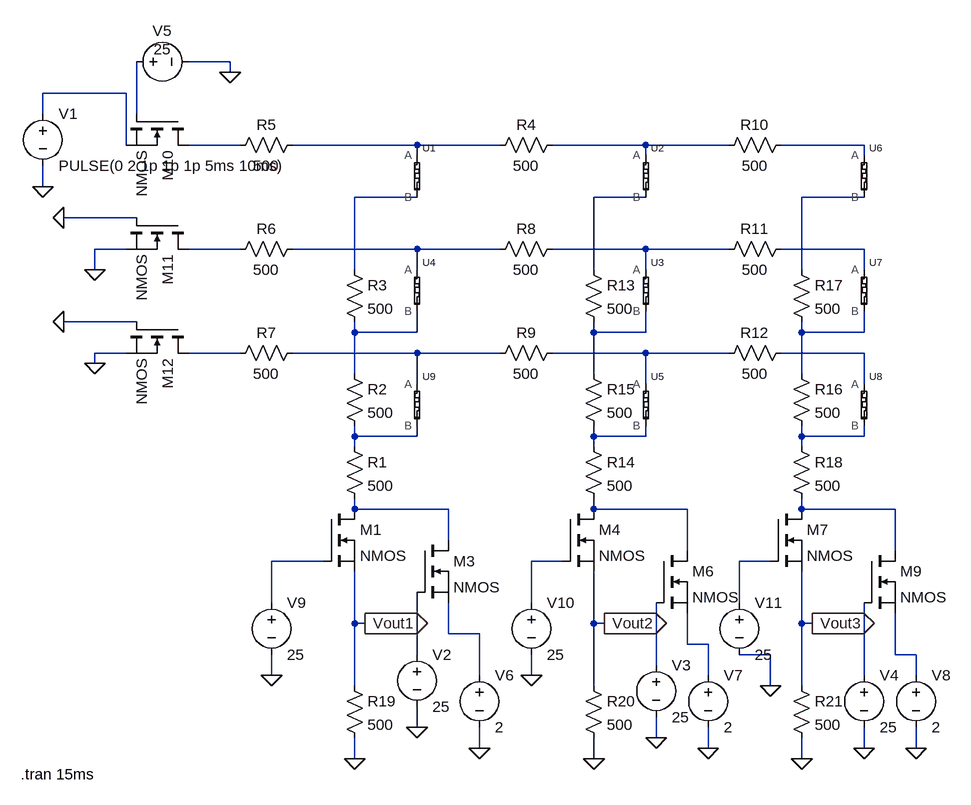
[diagram p0: schematic 3x3_crossbar.asc]
3x3_crossbar.asc, the LTspice schematic file:
Version 4
SHEET 1 1112 888
WIRE 0 -224 -64 -224
WIRE 0 -208 0 -224
WIRE -160 -176 -288 -176
WIRE -288 -144 -288 -176
WIRE -144 -144 -144 -224
WIRE -160 -96 -160 -176
WIRE 16 -96 -64 -96
WIRE 288 -96 96 -96
WIRE 416 -96 288 -96
WIRE 640 -96 496 -96
WIRE 768 -96 640 -96
WIRE 976 -96 848 -96
WIRE 288 -80 288 -96
WIRE 640 -80 640 -96
WIRE 976 -80 976 -96
WIRE -288 -32 -288 -64
WIRE 288 -16 192 -16
WIRE 640 -16 560 -16
WIRE 976 -16 880 -16
WIRE -144 16 -256 16
WIRE -160 64 -208 64
WIRE 16 64 -64 64
WIRE 288 64 96 64
WIRE 416 64 288 64
WIRE 640 64 496 64
WIRE 768 64 640 64
WIRE 976 64 848 64
WIRE -208 96 -208 64
WIRE 192 96 192 -16
WIRE 288 96 288 64
WIRE 560 96 560 -16
WIRE 640 96 640 64
WIRE 880 96 880 -16
WIRE 976 96 976 64
WIRE -144 176 -256 176
WIRE 192 192 192 176
WIRE 288 192 288 160
WIRE 288 192 192 192
WIRE 560 192 560 176
WIRE 640 192 640 160
WIRE 640 192 560 192
WIRE 880 192 880 176
WIRE 976 192 976 160
WIRE 976 192 880 192
WIRE -160 224 -208 224
WIRE 16 224 -64 224
WIRE 288 224 96 224
WIRE 416 224 288 224
WIRE 640 224 496 224
WIRE 768 224 640 224
WIRE 976 224 848 224
WIRE -208 240 -208 224
WIRE 192 256 192 192
WIRE 560 256 560 192
WIRE 880 256 880 192
WIRE 288 272 288 224
WIRE 640 272 640 224
WIRE 976 272 976 224
WIRE 192 352 192 336
WIRE 288 352 288 336
WIRE 288 352 192 352
WIRE 560 352 560 336
WIRE 640 352 640 336
WIRE 640 352 560 352
WIRE 880 352 880 336
WIRE 976 352 976 336
WIRE 976 352 880 352
WIRE 192 368 192 352
WIRE 560 368 560 352
WIRE 880 368 880 352
WIRE 192 464 192 448
WIRE 336 464 192 464
WIRE 560 464 560 448
WIRE 704 464 560 464
WIRE 880 464 880 448
WIRE 1024 464 880 464
WIRE 336 512 336 464
WIRE 704 528 704 464
WIRE 1024 528 1024 464
WIRE 144 544 64 544
WIRE 512 544 464 544
WIRE 832 544 784 544
WIRE 64 608 64 544
WIRE 464 608 464 544
WIRE 784 608 784 544
WIRE 192 640 192 560
WIRE 208 640 192 640
WIRE 560 640 560 560
WIRE 576 640 560 640
WIRE 880 640 880 560
WIRE 896 640 880 640
WIRE 336 656 336 608
WIRE 384 656 336 656
WIRE 704 672 704 624
WIRE 736 672 704 672
WIRE 288 688 288 592
WIRE 832 688 784 688
WIRE 1024 688 1024 624
WIRE 1056 688 1024 688
WIRE 656 704 656 608
WIRE 64 720 64 688
WIRE 384 720 384 656
WIRE 464 720 464 688
WIRE 736 720 736 672
WIRE 976 720 976 608
WIRE 1056 720 1056 688
WIRE 192 736 192 640
WIRE 560 736 560 640
WIRE 832 736 832 688
WIRE 880 736 880 640
WIRE 288 800 288 768
WIRE 656 816 656 784
WIRE 384 832 384 800
WIRE 736 832 736 800
WIRE 976 832 976 800
WIRE 1056 832 1056 800
WIRE 192 848 192 816
WIRE 560 848 560 816
WIRE 880 848 880 816
FLAG 192 848 0
FLAG 560 848 0
FLAG 880 848 0
FLAG -256 16 0
FLAG -256 176 0
FLAG -288 -32 0
FLAG 288 800 0
FLAG 656 816 0
FLAG 976 832 0
FLAG 0 -208 0
FLAG -208 96 0
FLAG -208 240 0
FLAG 64 720 0
FLAG 464 720 0
FLAG 832 736 0
FLAG 1056 832 0
FLAG 384 832 0
FLAG 736 832 0
FLAG 208 640 Vout1
IOPIN 208 640 Out
FLAG 576 640 Vout2
IOPIN 576 640 Out
FLAG 896 640 Vout3
IOPIN 896 640 Out
SYMBOL memristor_k 320 -32 R0
SYMATTR InstName U1
SYMBOL memristor_k 320 144 R0
SYMATTR InstName U4
SYMBOL memristor_k 320 320 R0
SYMATTR InstName U9
SYMBOL nmos 144 464 R0
SYMATTR InstName M1
SYMBOL nmos 288 512 R0
SYMATTR InstName M3
SYMBOL nmos 512 464 R0
SYMATTR InstName M4
SYMBOL nmos 656 528 R0
SYMATTR InstName M6
SYMBOL nmos 832 464 R0
SYMATTR InstName M7
SYMBOL nmos 976 528 R0
SYMATTR InstName M9
SYMBOL res 176 352 R0
SYMATTR InstName R1
SYMATTR Value 500
SYMBOL res 176 240 R0
SYMATTR InstName R2
SYMATTR Value 500
SYMBOL res 176 80 R0
SYMATTR InstName R3
SYMATTR Value 500
SYMBOL res 112 -112 R90
WINDOW 0 0 56 VBottom 2
WINDOW 3 32 56 VTop 2
SYMATTR InstName R5
SYMATTR Value 500
SYMATTR SpiceLine tol=1 pwr=0.1
SYMBOL res 112 48 R90
WINDOW 0 0 56 VBottom 2
WINDOW 3 32 56 VTop 2
SYMATTR InstName R6
SYMATTR Value 500
SYMBOL res 112 208 R90
WINDOW 0 0 56 VBottom 2
WINDOW 3 32 56 VTop 2
SYMATTR InstName R7
SYMATTR Value 500
SYMBOL nmos -64 -144 R90
SYMATTR InstName M10
SYMBOL nmos -64 16 R90
SYMATTR InstName M11
SYMBOL nmos -64 176 R90
SYMATTR InstName M12
SYMBOL memristor_k 672 -32 R0
SYMATTR InstName U2
SYMBOL memristor_k 672 144 R0
SYMATTR InstName U3
SYMBOL memristor_k 672 320 R0
SYMATTR InstName U5
SYMBOL memristor_k 1008 -32 R0
SYMATTR InstName U6
SYMBOL memristor_k 1008 144 R0
SYMATTR InstName U7
SYMBOL memristor_k 1008 320 R0
SYMATTR InstName U8
SYMBOL res 512 -112 R90
WINDOW 0 0 56 VBottom 2
WINDOW 3 32 56 VTop 2
SYMATTR InstName R4
SYMATTR Value 500
SYMBOL res 512 48 R90
WINDOW 0 0 56 VBottom 2
WINDOW 3 32 56 VTop 2
SYMATTR InstName R8
SYMATTR Value 500
SYMBOL res 512 208 R90
WINDOW 0 0 56 VBottom 2
WINDOW 3 32 56 VTop 2
SYMATTR InstName R9
SYMATTR Value 500
SYMBOL res 864 -112 R90
WINDOW 0 0 56 VBottom 2
WINDOW 3 32 56 VTop 2
SYMATTR InstName R10
SYMATTR Value 500
SYMBOL res 864 48 R90
WINDOW 0 0 56 VBottom 2
WINDOW 3 32 56 VTop 2
SYMATTR InstName R11
SYMATTR Value 500
SYMBOL res 864 208 R90
WINDOW 0 0 56 VBottom 2
WINDOW 3 32 56 VTop 2
SYMATTR InstName R12
SYMATTR Value 500
SYMBOL res 544 80 R0
SYMATTR InstName R13
SYMATTR Value 500
SYMBOL res 544 240 R0
SYMATTR InstName R15
SYMATTR Value 500
SYMBOL res 864 240 R0
SYMATTR InstName R16
SYMATTR Value 500
SYMBOL res 864 80 R0
SYMATTR InstName R17
SYMATTR Value 500
SYMBOL res 544 352 R0
SYMATTR InstName R14
SYMATTR Value 500
SYMBOL res 864 352 R0
SYMATTR InstName R18
SYMATTR Value 500
SYMBOL res 176 720 R0
SYMATTR InstName R19
SYMATTR Value 500
SYMBOL res 544 720 R0
SYMATTR InstName R20
SYMATTR Value 500
SYMBOL res 864 720 R0
SYMATTR InstName R21
SYMATTR Value 500
SYMBOL voltage -288 -160 R0
WINDOW 123 0 0 Left 0
WINDOW 39 0 0 Left 0
SYMATTR InstName V1
SYMATTR Value PULSE(0 2 1p 1p 1p 5ms 10ms)
SYMBOL voltage 288 672 R0
WINDOW 123 0 0 Left 0
WINDOW 39 0 0 Left 0
SYMATTR InstName V2
SYMATTR Value 25
SYMBOL voltage 656 688 R0
WINDOW 123 0 0 Left 0
WINDOW 39 0 0 Left 0
SYMATTR InstName V3
SYMATTR Value 25
SYMBOL voltage 976 704 R0
WINDOW 123 0 0 Left 0
WINDOW 39 0 0 Left 0
SYMATTR InstName V4
SYMATTR Value 25
SYMBOL voltage -160 -224 R270
WINDOW 0 32 56 VTop 2
WINDOW 3 4 56 VTop 2
WINDOW 123 0 0 Left 0
WINDOW 39 0 0 Left 0
SYMATTR InstName V5
SYMATTR Value 25
SYMBOL voltage 384 704 R0
WINDOW 123 0 0 Left 0
WINDOW 39 0 0 Left 0
SYMATTR InstName V6
SYMATTR Value 2
SYMBOL voltage 736 704 R0
WINDOW 123 0 0 Left 0
WINDOW 39 0 0 Left 0
SYMATTR InstName V7
SYMATTR Value 2
SYMBOL voltage 1056 704 R0
WINDOW 123 0 0 Left 0
WINDOW 39 0 0 Left 0
SYMATTR InstName V8
SYMATTR Value 2
SYMBOL voltage 64 592 R0
WINDOW 123 0 0 Left 0
WINDOW 39 0 0 Left 0
SYMATTR InstName V9
SYMATTR Value 25
SYMBOL voltage 464 592 R0
WINDOW 123 0 0 Left 0
WINDOW 39 0 0 Left 0
SYMATTR InstName V10
SYMATTR Value 25
SYMBOL voltage 784 592 R0
WINDOW 123 0 0 Left 0
WINDOW 39 0 0 Left 0
SYMATTR InstName V11
SYMATTR Value 25
TEXT -322 872 Left 2 !.tran 15ms

The netlist it stands for:
* 3x3_crossbar.asc
XU1 N004 N007 memristor  ; pins A B
XU4 N011 N014 memristor  ; pins A B
XU9 N018 N021 memristor  ; pins A B
M1 N024 N027 Vout1 Vout1 NMOS
M3 N024 N032 N030 N030 NMOS
M4 N025 N028 Vout2 Vout2 NMOS
M6 N025 N034 N031 N031 NMOS
M7 N026 N029 Vout3 Vout3 NMOS
M9 N026 N035 N033 N033 NMOS
R1 N021 N024 500
R2 N014 N021 500
R3 N007 N014 500
R5 N004 N003 500 tol=1 pwr=0.1
R6 N011 N010 500
R7 N018 N017 500
M10 N003 N002 N001 N001 NMOS
M11 N010 0 0 0 NMOS
M12 N017 0 0 0 NMOS
XU2 N005 N008 memristor  ; pins A B
XU3 N012 N015 memristor  ; pins A B
XU5 N019 N022 memristor  ; pins A B
XU6 N006 N009 memristor  ; pins A B
XU7 N013 N016 memristor  ; pins A B
XU8 N020 N023 memristor  ; pins A B
R4 N005 N004 500
R8 N012 N011 500
R9 N019 N018 500
R10 N006 N005 500
R11 N013 N012 500
R12 N020 N019 500
R13 N008 N015 500
R15 N015 N022 500
R16 N016 N023 500
R17 N009 N016 500
R14 N022 N025 500
R18 N023 N026 500
R19 Vout1 0 500
R20 Vout2 0 500
R21 Vout3 0 500
V1 N001 0 PULSE(0 2 1p 1p 1p 5ms 10ms)
V2 N032 0 25
V3 N034 0 25
V4 N035 0 25
V5 N002 0 25
V6 N030 0 2
V7 N031 0 2
V8 N033 0 2
V9 N027 0 25
V10 N028 0 25
V11 N029 0 25
.model NMOS NMOS
.model PMOS PMOS
.lib standard.mos
.tran 15ms
.lib memristor.sub
.backanno
.end